# EAGLE design MocoMoco (EAGLE 6.5.0)
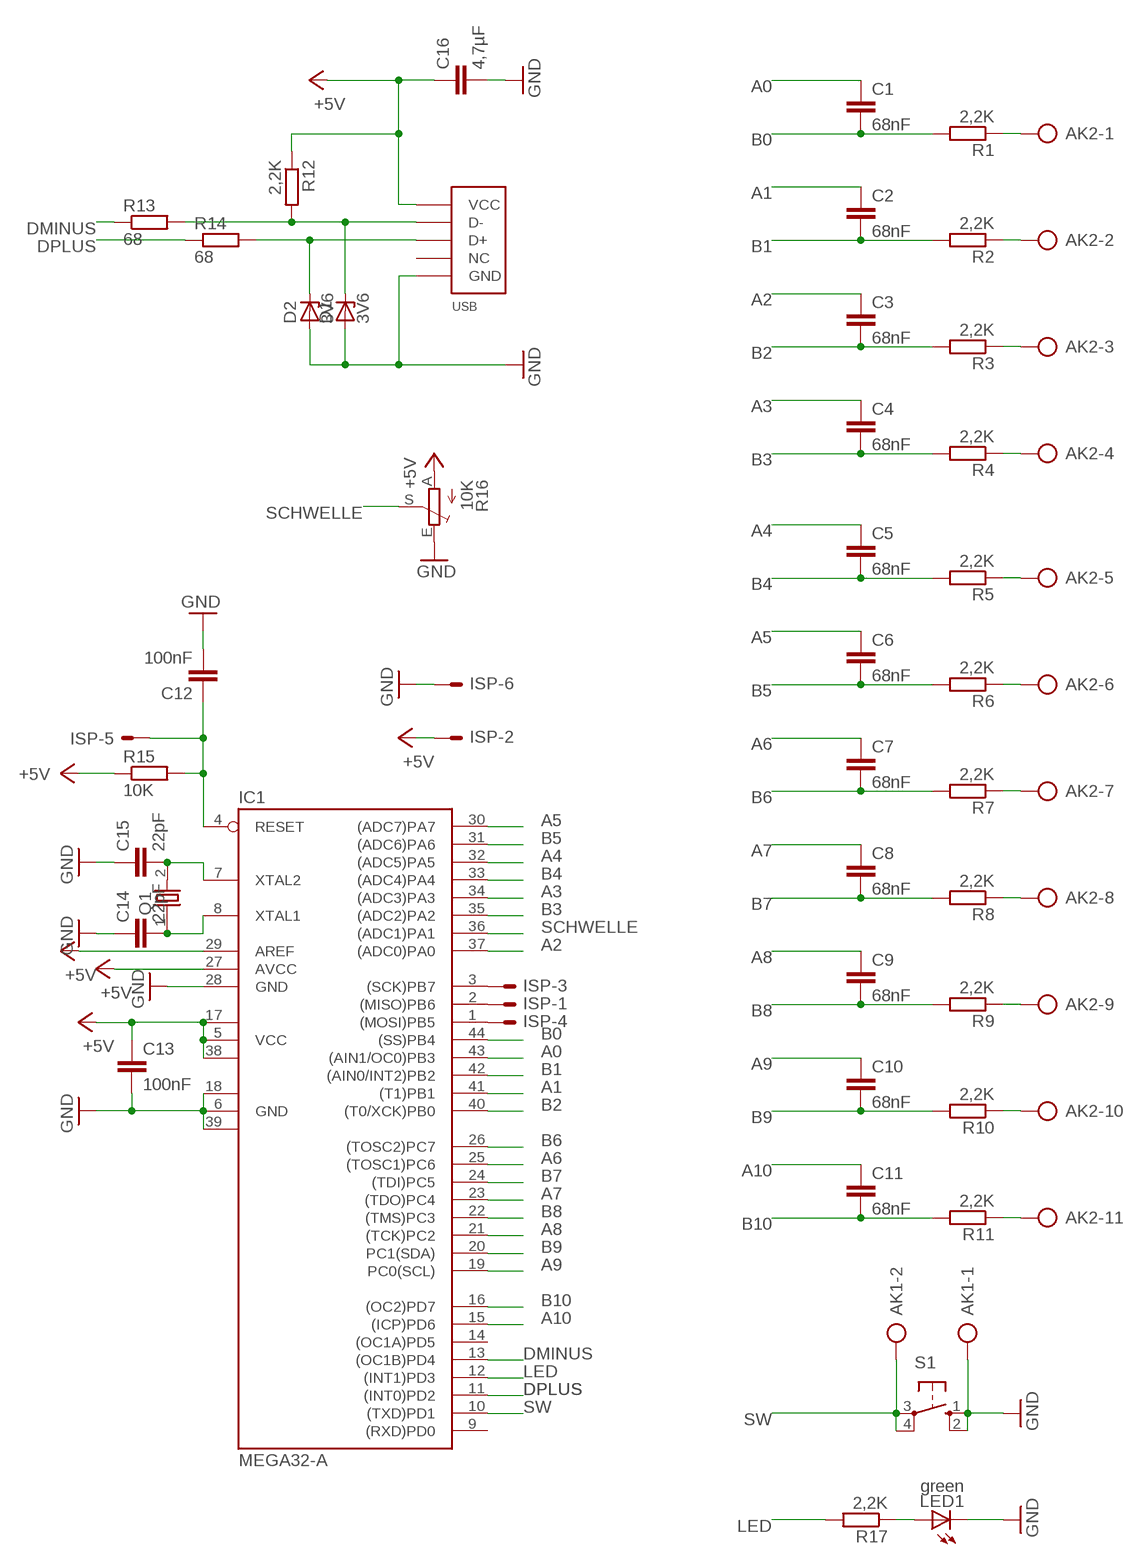
[diagram p0: schematic, sheet 1]

## Parts
AK1  AK2  [AK/2]
AK2  AK11  [AK/11]
C1  68nF  C-EUC0805K  [C0805K]
C2  68nF  C-EUC0805K  [C0805K]
C3  68nF  C-EUC0805K  [C0805K]
C4  68nF  C-EUC0805K  [C0805K]
C5  68nF  C-EUC0805K  [C0805K]
C6  68nF  C-EUC0805K  [C0805K]
C7  68nF  C-EUC0805K  [C0805K]
C8  68nF  C-EUC0805K  [C0805K]
C9  68nF  C-EUC0805K  [C0805K]
C10  68nF  C-EUC0805K  [C0805K]
C11  68nF  C-EUC0805K  [C0805K]
C12  100nF  C-EUC0805K  [C0805K]
C13  100nF  C-EUC0805K  [C0805K]
C14  22pF  C-EUC0805K  [C0805K]
C15  22pF  C-EUC0805K  [C0805K]
C16  4,7µF  C-EUC3216  [C3216]
D1  3V6  BZX84CSMD  [TO236]
D2  3V6  BZX84CSMD  [TO236]
IC1  MEGA32-A  [TQFP44]
ISP  ML6E  [ML6]
LED1  green  LEDCHIP-LED0603  [CHIP-LED0603]
Q1  HC-49/US  [HC49UP]
R1  2,2K  R-EUR0603  [R0603]
R2  2,2K  R-EUR0603  [R0603]
R3  2,2K  R-EUR0603  [R0603]
R4  2,2K  R-EUR0603  [R0603]
R5  2,2K  R-EUR0603  [R0603]
R6  2,2K  R-EUR0603  [R0603]
R7  2,2K  R-EUR0603  [R0603]
R8  2,2K  R-EUR0603  [R0603]
R9  2,2K  R-EUR0603  [R0603]
R10  2,2K  R-EUR0603  [R0603]
R11  2,2K  R-EUR0603  [R0603]
R12  2,2K  R-EUR0603  [R0603]
R13  68  R-EUR0603  [R0603]
R14  68  R-EUR0603  [R0603]
R15  10K  R-EUR0603  [R0603]
R16  10K  TRIM_EU-LI10  [LI10]
R17  2,2K  R-EUR0603  [R0603]
S1  10-XX  [B3F-10XX]
USB  MICRO_USB  [MICRO_USB_A01SB141B1-292]

## Nets
+5V: C13.1 C16.1 IC1.5(VCC) IC1.17(VCC1) IC1.27(AVCC) IC1.29(AREF) IC1.38(VCC2) ISP.2 R12.1 R15.1 R16.A USB.P$1(VCC)
A0: C1.1 IC1.43((AIN1/OC0)PB3)
A1: C2.1 IC1.41((T1)PB1)
A2: C3.1 IC1.37((ADC0)PA0)
A3: C4.1 IC1.34((ADC3)PA3)
A4: C5.1 IC1.32((ADC5)PA5)
A5: C6.1 IC1.30((ADC7)PA7)
A6: C7.1 IC1.25((TOSC1)PC6)
A7: C8.1 IC1.23((TDO)PC4)
A8: C9.1 IC1.21((TCK)PC2)
A9: C10.1 IC1.19(PC0(SCL))
A10: C11.1 IC1.15((ICP)PD6)
B0: C1.2 IC1.44((SS)PB4) R1.2
B1: C2.2 IC1.42((AIN0/INT2)PB2) R2.2
B2: C3.2 IC1.40((T0/XCK)PB0) R3.2
B3: C4.2 IC1.35((ADC2)PA2) R4.2
B4: C5.2 IC1.33((ADC4)PA4) R5.2
B5: C6.2 IC1.31((ADC6)PA6) R6.2
B6: C7.2 IC1.26((TOSC2)PC7) R7.2
B7: C8.2 IC1.24((TDI)PC5) R8.2
B8: C9.2 IC1.22((TMS)PC3) R9.2
B9: C10.2 IC1.20(PC1(SDA)) R10.2
B10: C11.2 IC1.16((OC2)PD7) R11.2
DMINUS: IC1.13((OC1B)PD4) R13.1
DPLUS: IC1.11((INT0)PD2) R14.1
GND: AK1.1 C12.2 C13.2 C14.1 C15.1 C16.2 D1.A D2.A IC1.6(GND) IC1.18(GND1) IC1.28(GND) IC1.39(GND2) ISP.6 LED1.C R16.E S1.1(S) S1.2(S1) USB.P$5(GND)
LED: IC1.12((INT1)PD3) R17.2
N$1: AK2.1 R1.1
N$2: AK2.2 R2.1
N$3: C15.2 IC1.7(XTAL2) Q1.2
N$4: AK2.4 R4.1
N$5: D1.C R12.2 R13.2 USB.P$2(D-)
N$6: AK2.5 R5.1
N$7: AK2.6 R6.1
N$8: D2.C R14.2 USB.P$3(D+)
N$9: AK2.7 R7.1
N$10: IC1.1((MOSI)PB5) ISP.4
N$11: IC1.3((SCK)PB7) ISP.3
N$12: AK2.8 R8.1
N$13: C12.1 IC1.4(RESET) ISP.5 R15.2
N$14: IC1.2((MISO)PB6) ISP.1
N$15: AK2.9 R9.1
N$16: AK2.10 R10.1
N$17: AK2.11 R11.1
N$18: AK2.3 R3.1
N$19: C14.2 IC1.8(XTAL1) Q1.1
N$21: LED1.A R17.1
SCHWELLE: IC1.36((ADC1)PA1) R16.S
SW: AK1.2 IC1.10((TXD)PD1) S1.3(P) S1.4(P1)
Unconnected: IC1.9((RXD)PD0) IC1.14((OC1A)PD5) USB.P$4(NC)

## Library data of the parts
AK1 = !Häufige Bauteile:AK2
AK2 = !Häufige Bauteile:AK11
C1-C16 = rcl:C-EU: CAPACITOR, European symbol
D1 D2 = diode:BZX84CSMD: Z DIODE
IC1 = atmel:MEGA32: MICROCONTROLLER 32 Kbytes FLASH 2 Kbytes SRAM 1 Kbytes EEPROM USART 8-channel 10 bit ADC Source: www.atmel.com .. doc2503.pdf; MPN: ATMEGA32-16AU; OC_FARNELL: 9171274; OC_NEWARK: 69K6677
ISP = !Eigene Library SMD:ML6E
LED1 = led:LED: LED OSRAM: - CHIPLED LG R971, LG N971, LY N971, LG Q971, LY Q971, LO R971, LY R971 LH N974, LH R974 LS Q976, LO Q976, LY Q976 LO Q996 - Hyper CHIPLED LW Q18S LB Q993, LB Q99A, LB R99A - SideLED LS A670, LO A670, LY A670, LG A670, LP A670 LB A673, LV A673, LT A673, LW A673 LH A674 LY A675 LS A676, LA A676, LO A676, LY A676, LW A676 LS A679, LY A679, LG A679 - Hyper Micro SIDELED® LS Y876, LA Y876, LO Y876, LY Y876 LT Y87S - SmartLED LW L88C, LW L88S LB L89C, LB L89S, LG L890 LS L89K, LO L89K, LY L89K LS L896, LA L896, LO L896, LY L896 - TOPLED LS T670, LO T670, LY T670, LG T670, LP T670 LSG T670, LSP T670, LSY T670, LOP T670, LYG T670 LG T671, LOG T671, LSG T671 LB T673, LV T673, LT T673, LW T673 LH T674 LS T676, LA T676, LO T676, LY T676, LB T676, LH T676, LSB T676, LW T676 LB T67C, LV T67C, LT T67C, LS T67K, LO T67K, LY T67K, LW E67C LS E67B, LA E67B, LO E67B, LY E67B, LB E67C, LV E67C, LT E67C LW T67C LS T679, LY T679, LG T679 LS T770, LO T770, LY T770, LG T770, LP T770 LB T773, LV T773, LT T773, LW T773 LH T774 LS E675, LA E675, LY E675, LS T675 LS T776, LA T776, LO T776, LY T776, LB T776 LHGB T686 LT T68C, LB T68C - Hyper Mini TOPLED® LB M676 - Mini TOPLED Santana® LG M470 LS M47K, LO M47K, LY M47K Source: http://www.osram.convergy.de LUXEON: - LUMILED® LXK2-PW12-R00, LXK2-PW12-S00, LXK2-PW14-U00, LXK2-PW14-V00 LXK2-PM12-R00, LXK2-PM12-S00, LXK2-PM14-U00 LXK2-PE12-Q00, LXK2-PE12-R00, LXK2-PE12-S00, LXK2-PE14-T00, LXK2-PE14-U00 LXK2-PB12-K00, LXK2-PB12-L00, LXK2-PB12-M00, LXK2-PB14-N00, LXK2-PB14-P00, LXK2-PB14-Q00 LXK2-PR12-L00, LXK2-PR12-M00, LXK2-PR14-Q00, LXK2-PR14-R00 LXK2-PD12-Q00, LXK2-PD12-R00, LXK2-PD12-S00 LXK2-PH12-R00, LXK2-PH12-S00 LXK2-PL12-P00, LXK2-PL12-Q00, LXK2-PL12-R00 Source: www.luxeon.com KINGBRIGHT: KA-3528ASYC Source: www.kingbright.com
Q1 = !Eigene Library SMD:HC-49/US: CRYSTAL
R1-R15 R17 = !Eigene Library SMD:R-EU
R16 = pot:TRIM_EU-: POTENTIOMETER
S1 = !Häufige Bauteile:10-XX: OMRON SWITCH; MPN: B3F-1000; OC_FARNELL: 176432; OC_NEWARK: 36M3542
USB = !Eigene Library SMD:MICRO_USB

## Board
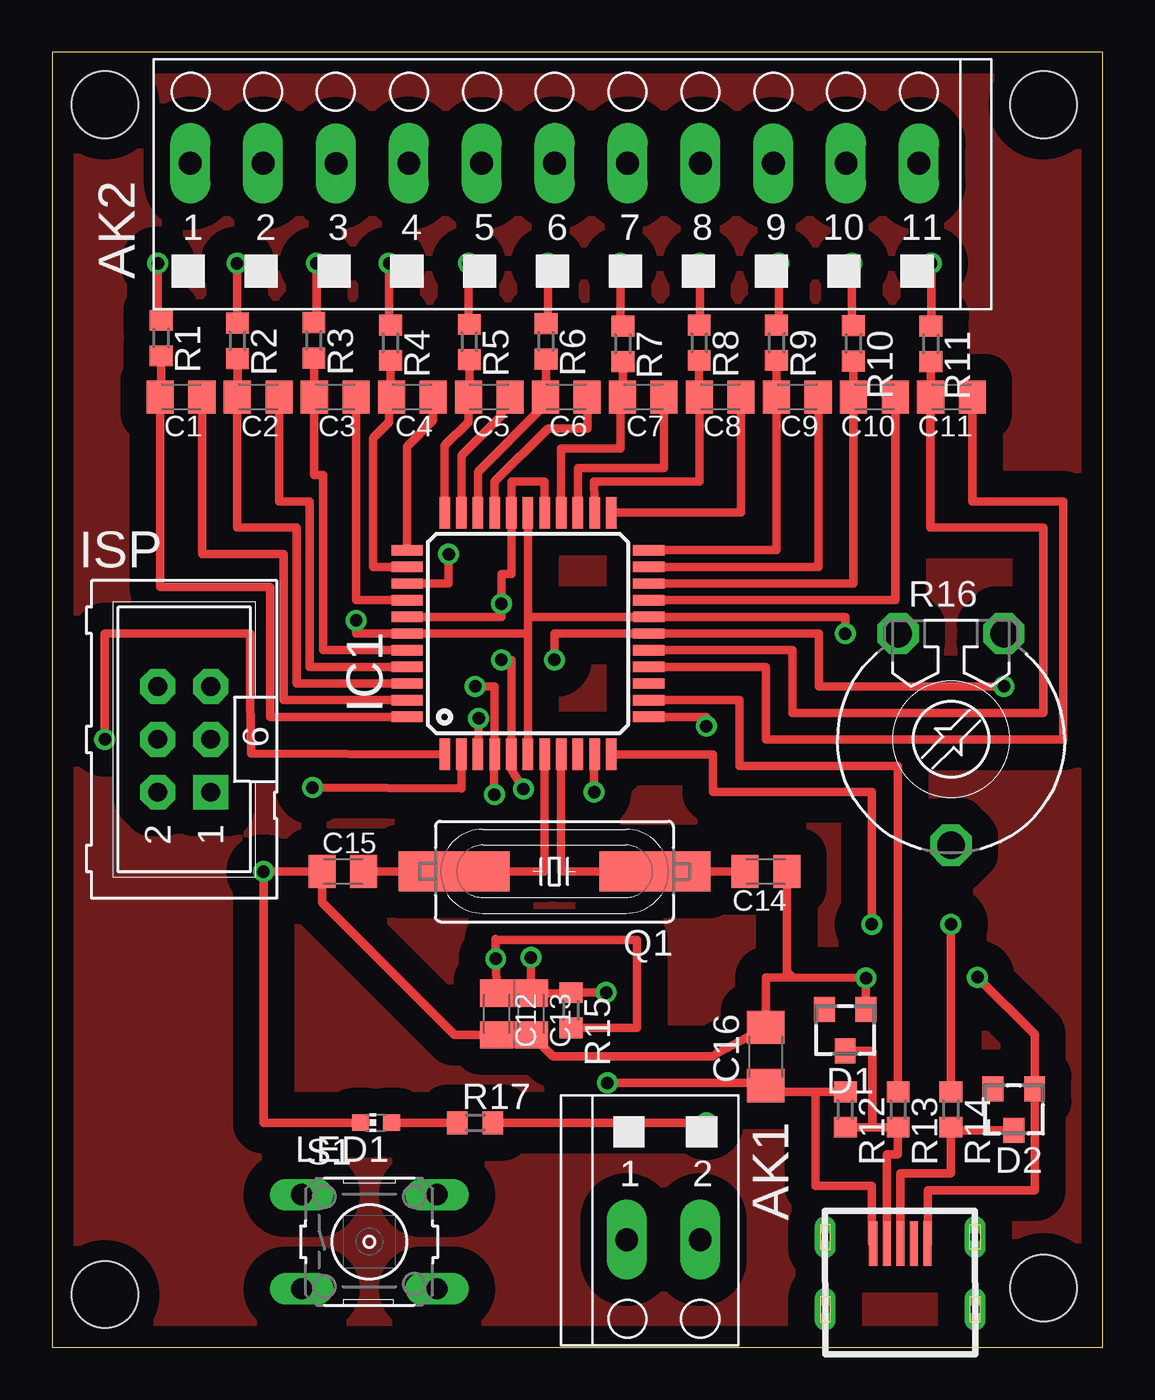
[diagram p1: board, top side]
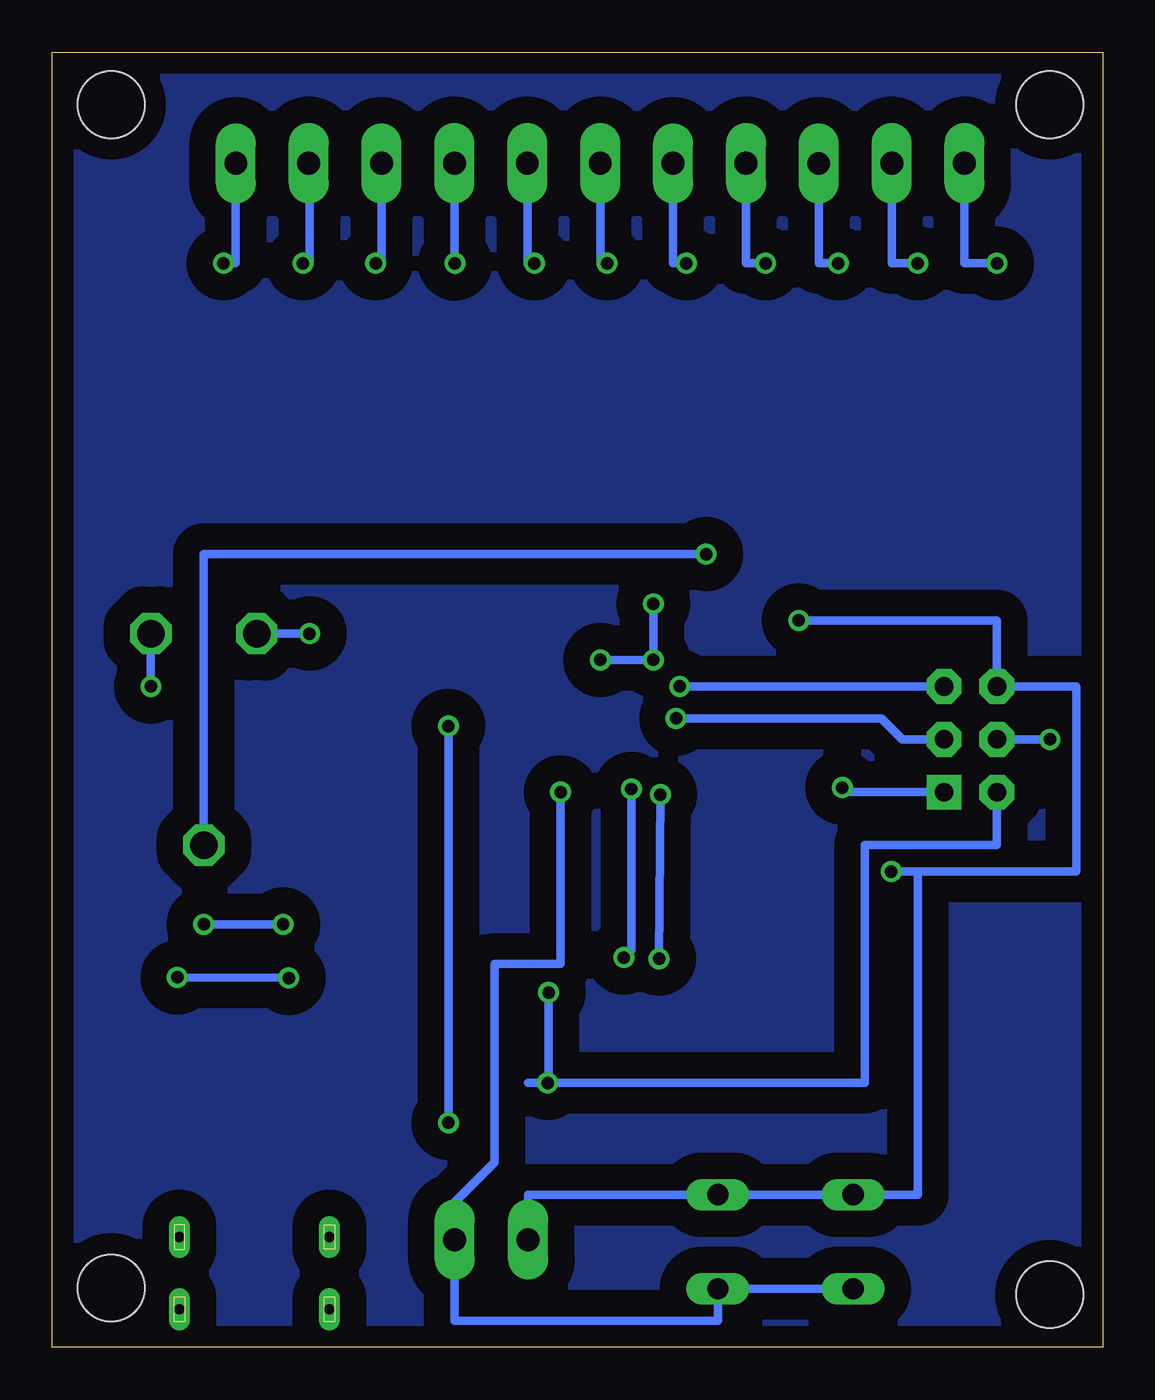
[diagram p2: board, bottom side, seen from below]

Size 50.47 x 62.22 mm. Coordinates in mm from the lower left corner, seen from the top.
Outline: 0,0 50.47,0 50.47,62.22 0,62.22 0,0
Copper layers (1*16): Top 0.035mm / dielectric 1.5mm / Bottom 0.035mm
Design rules "default *": minimum track width 10mil, minimum drill 24mil, track to track 50mil, track to pad 50mil, pad to pad 50mil, via to via 50mil, smd to smd 50mil, copper to edge 40mil, drill to drill 8mil, minimum pad ring 10mil, minimum via ring 8mil, stop-mask expansion 4mil, vias tented up to drill 0mil, thermal gap 10mil
Holes 3.2 mm at 2.54,59.69 47.62,59.69 47.62,2.86 2.54,2.54

### Footprints (pad centres in the part's own frame; a part is rotated, then mirrored left to right if it is on the bottom)
AK/2 = drill 1.1 pad 1.93 long: 1 1.605,1.17; 2 -1.925,1.17
AK/11 = drill 1.1 pad 1.93 long: 1 -17.49,1; 2 -13.991,1; 3 -10.486,0.991; 4 -6.994,1.005; 5 -3.49,0.995; 6 0.006,1.005; 7 3.511,1; 8 7.008,1.005; 9 10.513,0.995; 10 14.014,1; 11 17.51,0.995
C0805K = smd 1.3 x 1.6: 1 -1,0; 2 1,0
C3216 = smd 1.6 x 1.8: 1 -1.4,0; 2 1.4,0
TO236 = smd 1 x 1.2: A -1,-1; C 0,1; NC 1,-1
TQFP44 = smd 1.5 x 0.5: 1 -5.8,4; 2 -5.8,3.2; 3 -5.8,2.4; 4 -5.8,1.6; 5 -5.8,0.8; 6 -5.8,0; 7 -5.8,-0.8; 8 -5.8,-1.6; 9 -5.8,-2.4; 10 -5.8,-3.2; 11 -5.8,-4; 23 5.8,-4; 24 5.8,-3.2; 25 5.8,-2.4; 26 5.8,-1.6; 27 5.8,-0.8; 28 5.8,0; 29 5.8,0.8; 30 5.8,1.6; 31 5.8,2.4; 32 5.8,3.2; 33 5.8,4 | smd 0.5 x 1.5: 12 -4,-5.8; 13 -3.2,-5.8; 14 -2.4,-5.8; 15 -1.6,-5.8; 16 -0.8,-5.8; 17 0,-5.8; 18 0.8,-5.8; 19 1.6,-5.8; 20 2.4,-5.8; 21 3.2,-5.8; 22 4,-5.8; 34 4,5.8; 35 3.2,5.8; 36 2.4,5.8; 37 1.6,5.8; 38 0.8,5.8; 39 0,5.8; 40 -0.8,5.8; 41 -1.6,5.8; 42 -2.4,5.8; 43 -3.2,5.8; 44 -4,5.8
ML6 = drill 0.9 pad 1.676 square: 1 -2.54,-1.27 | drill 0.9 pad 1.676 octagon: 2 -2.54,1.27; 3 0,-1.27; 4 0,1.27; 5 2.54,-1.27; 6 2.54,1.27
CHIP-LED0603 = smd 0.8 x 0.8: A 0,-0.75; C 0,0.75
HC49UP = smd 5.334 x 1.93: 1 -4.826,0; 2 4.826,0
R0603 = smd 1 x 1.1: 1 -0.85,0; 2 0.85,0
LI10 = drill 1.321 octagon: A -2.54,-5.08; E 2.54,-5.08; S 0,5.08
B3F-10XX = drill 1.016 long: 1 -3.251,2.261; 2 3.251,2.261; 3 -3.251,-2.261; 4 3.251,-2.261
MICRO_USB_A01SB141B1-292 = drill 0.5 pad 1.016 long: NC1 -3.493,2.763; NC2 -3.493,-0.708; NC3 3.708,2.763; NC4 3.708,-0.708 | smd 0.4 x 2.15: P$1 -1.192,2.453; P$2 -0.542,2.453; P$3 0.107,2.453; P$4 0.757,2.453; P$5 1.407,2.453

### Placement (x,y rotation side)
AK1  29.21,6.35 180 top
AK2  24.13,55.88 0 top
C1  6.2,45.65 180 top
C2  9.9,45.65 180 top
C3  13.6,45.65 180 top
C4  17.3,45.65 180 top
C5  21,45.65 180 top
C6  24.7,45.65 180 top
C7  28.4,45.65 180 top
C8  32.1,45.65 180 top
C9  35.8,45.65 180 top
C10  39.5,45.65 180 top
C11  43.2,45.65 180 top
C12  21.36,16.02 270 top
C13  23.02,16.02 270 top
C14  34.29,22.86 180 top
C15  13.97,22.86 0 top
C16  34.29,13.97 90 top
D1  38.1,15.24 180 top
D2  46.2,11.43 180 top
IC1  22.86,34.29 90 top
ISP  6.35,29.21 90 top
LED1  15.56,10.79 90 top
Q1  24.13,22.86 180 top
R1  5.24,48.48 270 top
R2  8.9,48.35 270 top
R3  12.58,48.37 270 top
R4  16.26,48.26 270 top
R5  20.04,48.29 270 top
R6  23.73,48.32 270 top
R7  27.42,48.2 270 top
R8  31.08,48.26 270 top
R9  34.8,48.26 270 top
R10  38.5,48.23 270 top
R11  42.22,48.2 270 top
R12  38.1,11.43 270 top
R13  40.64,11.43 270 top
R14  43.18,11.43 270 top
R15  24.92,16.19 270 top
R16  43.18,29.21 180 top
R17  20.32,10.79 0 top
S1  15.24,5.08 0 top
USB  40.64,2.54 0 top

### Tracks (layer width: path | path; a pad name or v marks a point on that pad's centre or on a via)
+5V  (via drill 0.6)
  Top 0.406: IC1.5 | IC1.38 21.59,35.09 v21.59,35.72 21.59,37.15 22.07,37.15 IC1.29 22.06,41.59 23.65,41.59 IC1.27 | v24.13,33.02 24.13,34.29 IC1.17 36.83,34.29 36.83,31.75 v45.72,31.75 | v21.59,33.02 22.06,33.02 IC1.5 | USB.P$1 39.39,4.99 39.39,7.75 36.67,7.75 36.67,12.28 | 36.67,12.28 R12.1 | 36.67,12.28 34.29,12.28 C16.1 34.16,12.7 | 26.67,12.93 v26.67,12.7 34.16,12.7 | IC1.5 | IC1.5 22.06,27.88 22.11,27.65 v22.64,26.82 | v23.01,18.73 23.01,17.03 C13.1 24.9,17.02 R15.1 v26.61,17.04 v26.62,17.05 | 34.29,12.7 34.16,12.7
  Bottom 0.406: v24.13,33.02 v21.59,33.02 v21.59,35.72 | v22.64,26.82 22.64,19.09 v23.01,18.73 | v26.62,17.05 26.62,12.75 v26.67,12.7 | ISP.2 5.08,24.13 11.43,24.13 11.43,12.7 v26.67,12.7 | 27.61,12.7 v26.67,12.7 | v45.72,31.75 R16.A
A0
  Top 0.406: IC1.43 11.11,31.09 11.11,38.1 7.2,38.1 C1.1
A1
  Top 0.406: IC1.41 12.38,32.69 12.38,40.64 10.9,40.64 C2.1
A2
  Top 0.406: IC1.37 14.6,35.89 C3.1
A3
  Top 0.406: C4.1 18.3,44.54 17.05,43.27 IC1.34
A4
  Top 0.406: IC1.32 19.66,42.84 21.59,44.77 21.59,45.24 C5.1
A5
  Top 0.406: IC1.30 21.26,41.58 23.81,44.13 25.72,44.13 25.72,45.63 C6.1
A6
  Top 0.406: IC1.25 25.26,42.23 29.4,42.23 C7.1
A7
  Top 0.406: IC1.23 33.1,40.09 C8.1
A8
  Top 0.406: IC1.21 36.8,37.49 C9.1
A9
  Top 0.406: IC1.19 40.5,35.89 C10.1
A10
  Top 0.406: IC1.15 34.29,32.69 34.29,29.21 48.58,29.21 48.58,40.64 44.2,40.64 C11.1
B0
  Top 0.406: IC1.44 10.48,30.29 10.48,36.51 5.2,36.51 C1.2 5.24,45.65 R1.2
B1
  Top 0.406: IC1.42 11.75,31.89 11.75,39.37 8.9,39.37 C2.2 R2.2
B2
  Top 0.406: IC1.40 13.02,33.49 13.02,41.91 12.6,41.91 C3.2 12.58,45.65 R3.2
B3
  Top 0.406: IC1.35 15.42,37.49 15.42,43.68 16.19,44.45 16.19,45.54 C4.2 | C4.2 16.26,45.65 R4.2 | 16.3,45.02 C4.2
B4
  Top 0.406: R5.2 20.04,45.65 C5.2 20,44.45 18.86,43.31 IC1.33
B5
  Top 0.406: R6.2 23.73,45.65 C6.2 23.5,45.45 23.5,45.09 20.46,42.05 IC1.31
B6
  Top 0.406: R7.2 27.42,45.65 C7.2 27.3,45.55 27.3,43.18 24.45,43.18 24.46,41.58 IC1.26
B7
  Top 0.406: R8.2 31.08,45.65 C8.2 31.1,41.59 26.04,41.59 26.06,40.66 IC1.24
B8
  Top 0.406: R9.2 C9.2 34.8,38.29 IC1.22
B9
  Top 0.406: R10.2 C10.2 38.5,36.69 IC1.20
B10
  Top 0.406: R11.2 42.22,45.65 C11.2 42.2,39.37 47.62,39.37 47.62,30.48 35.56,30.48 35.56,33.49 IC1.16
DMINUS
  Top 0.406: IC1.13 28.66,31.11 33.02,31.11 33.02,27.94 40.62,27.94 40.62,12.3 R13.1
DPLUS  (via drill 0.6)
  Top 0.406: v43.18,20.32 R14.1 | IC1.11 31.75,28.49 31.75,26.67 39.37,26.67 v39.37,20.32
  Bottom 0.406: v39.37,20.32 v43.18,20.32
GND  (via drill 0.6)
  Top 0.406: 22.86,34.29 IC1.39 14.61,34.29 v14.61,34.92 | 22.86,34.29 22.86,35.09 | 22.86,35.09 IC1.28 | 22.86,35.09 IC1.18 38.1,35.09 v38.1,34.29 | USB.P$5 42.08,4.99 42.08,7.54 47.2,7.54 D2.A 47.2,15.03 v44.45,17.78 | 35.56,17.78 34.29,17.78 C16.2 31.88,14.1 31.75,13.97 24.07,13.97 C13.2 C12.2 19.32,15.02 12.96,21.38 C15.1 v10.16,22.86 10.16,10.79 LED1.C | 35.56,17.78 v39.1,17.75 39.1,17.78 D1.A | C14.1 35.29,18.05 35.56,17.78 | IC1.6 22.86,34.29
  Bottom 0.406: v44.45,17.78 v39.1,17.75 | 8.89,22.86 1.27,22.86 1.27,31.75 ISP.6 5.08,34.92 v14.61,34.92 | 8.89,22.86 v10.16,22.86 | v38.1,34.29 R16.E | S1.2 S1.1 | S1.2 27.61,7.34 AK1.1 | S1.2 8.89,7.34 8.89,22.86
LED  (via drill 0.6)
  Top 0.406: IC1.12 31.43,30.29 v31.43,29.84 | R17.2 v31.43,10.79
  Bottom 0.406: v31.43,29.84 v31.43,10.79
N$1  (via drill 0.6)
  Top 0.406: R1.1 5.08,49.33 v5.08,52.07
  Bottom 0.406: v5.08,52.07 6.64,52.07 AK2.1
N$2  (via drill 0.6)
  Top 0.406: R2.1 v8.89,52.07
  Bottom 0.406: v8.89,52.07 10.14,52.07 AK2.2
N$3
  Top 0.406: IC1.7 23.66,22.86 Q1.2 C15.2
N$4  (via drill 0.6)
  Top 0.406: R4.1 16.19,49.11 v16.19,52.07
  Bottom 0.406: v16.19,52.07 17.14,52.07 AK2.4
N$5
  Top 0.406: USB.P$2 40.1,6.26 40.1,9.27 40.64,9.27 R13.2 39.4,10.58 | R12.2 39.4,10.58 | D1.C 39.4,14.24 39.4,10.58
N$6  (via drill 0.6)
  Top 0.406: R5.1 20,49.14 v20,52.07
  Bottom 0.406: v20,52.07 20.64,52.07 AK2.5
N$7  (via drill 0.6)
  Top 0.406: R6.1 23.81,49.17 v23.81,52.07
  Bottom 0.406: v23.81,52.07 24.14,52.07 AK2.6
N$8
  Top 0.406: USB.P$3 40.74,6.26 40.74,8.36 43.18,8.36 R14.2 43.33,10.43 D2.C
N$9  (via drill 0.6)
  Top 0.406: R7.1 27.3,49.05 v27.3,52.07
  Bottom 0.406: v27.3,52.07 27.64,52.07 AK2.7
N$10  (via drill 0.6)
  Top 0.406: IC1.1 9.56,28.52 9.53,31.09 9.53,34.29 2.54,34.29 v2.54,29.21
  Bottom 0.406: v2.54,29.21 ISP.4
N$11  (via drill 0.6)
  Top 0.406: IC1.3 v20.49,30.21
  Bottom 0.406: v20.49,30.21 10.64,30.21 9.64,29.21 ISP.3
N$12  (via drill 0.6)
  Top 0.406: R8.1 31.11,49.11 v31.11,52.07
  Bottom 0.406: v31.11,52.07 31.14,51.75 AK2.8
N$13  (via drill 0.6)
  Top 0.406: v21.25,26.55 21.21,28.49 IC1.4 21.26,31.75 v20.32,31.75 | C12.1 21.33,18.65 v21.31,18.67 v21.31,18.68 21.31,19.61 21.35,19.57 28.09,19.57 28.09,15.36 | R15.2 27.94,15.34 | 27.94,15.34 28.07,15.34 28.09,15.36 | 28.09,15.36 27.94,15.34
  Bottom 0.406: v21.25,26.55 v21.31,18.67 | ISP.5 v20.32,31.75
N$14  (via drill 0.6)
  Top 0.406: IC1.2 19.66,26.86 v12.52,26.89
  Bottom 0.406: v12.52,26.89 12.3,26.67 ISP.1
N$15  (via drill 0.6)
  Top 0.406: R9.1 34.92,49.11 v34.92,52.07
  Bottom 0.406: v34.92,52.07 34.64,52.07 AK2.9
N$16  (via drill 0.6)
  Top 0.406: R10.1 38.42,49.08 v38.42,52.07
  Bottom 0.406: v38.42,52.07 38.1,52.07 38.1,57.15 38.14,57.15 AK2.10
N$17  (via drill 0.6)
  Top 0.406: R11.1 v42.23,52.07
  Bottom 0.406: v42.23,52.07 41.64,52.07 AK2.11
N$18  (via drill 0.6)
  Top 0.406: R3.1 12.7,49.22 v12.7,52.07
  Bottom 0.406: v12.7,52.07 13.64,52.07 AK2.3
N$19
  Top 0.406: IC1.8 24.46,22.86 Q1.1 C14.2
N$20
  pour Bottom: 0,62.23 50.8,62.23 50.8,0 0,0
N$21
  Top 0.406: LED1.A R17.1
N$22
  pour Top: 0,62.23 50.8,62.23 50.8,0 0,0
SCHWELLE  (via drill 0.6)
  Top 0.406: IC1.36 19.05,36.69 v19.05,38.1
  Bottom 0.406: v19.05,38.1 43.18,38.1 R16.S
SW  (via drill 0.6)
  Top 0.406: IC1.10 26.04,28.49 v26.04,26.67
  Bottom 0.406: v26.04,26.67 26.04,18.41 29.21,18.41 29.21,8.89 31.14,6.96 AK1.2 31.14,1.27 18.49,1.27 S1.4 S1.3

### Text on the board
Document: W | S | A | D | Up | Lft | Dow | Rgt | Spc | Ent | Strg | T. Stuckenberg / 24.02.2016 | + | - | MocoMoco V1.2 / inspired by / MakeyMakey | touchiness | USB
bDocu: Up | Dow | Lft | Rgt | W | S | A | D | Spc | Ent | Strg | copyright Tobias Stuckenberg / mocomoco@pinundport.de